# EAGLE schematic processor_toycathon v5 (EAGLE 9.7.0)
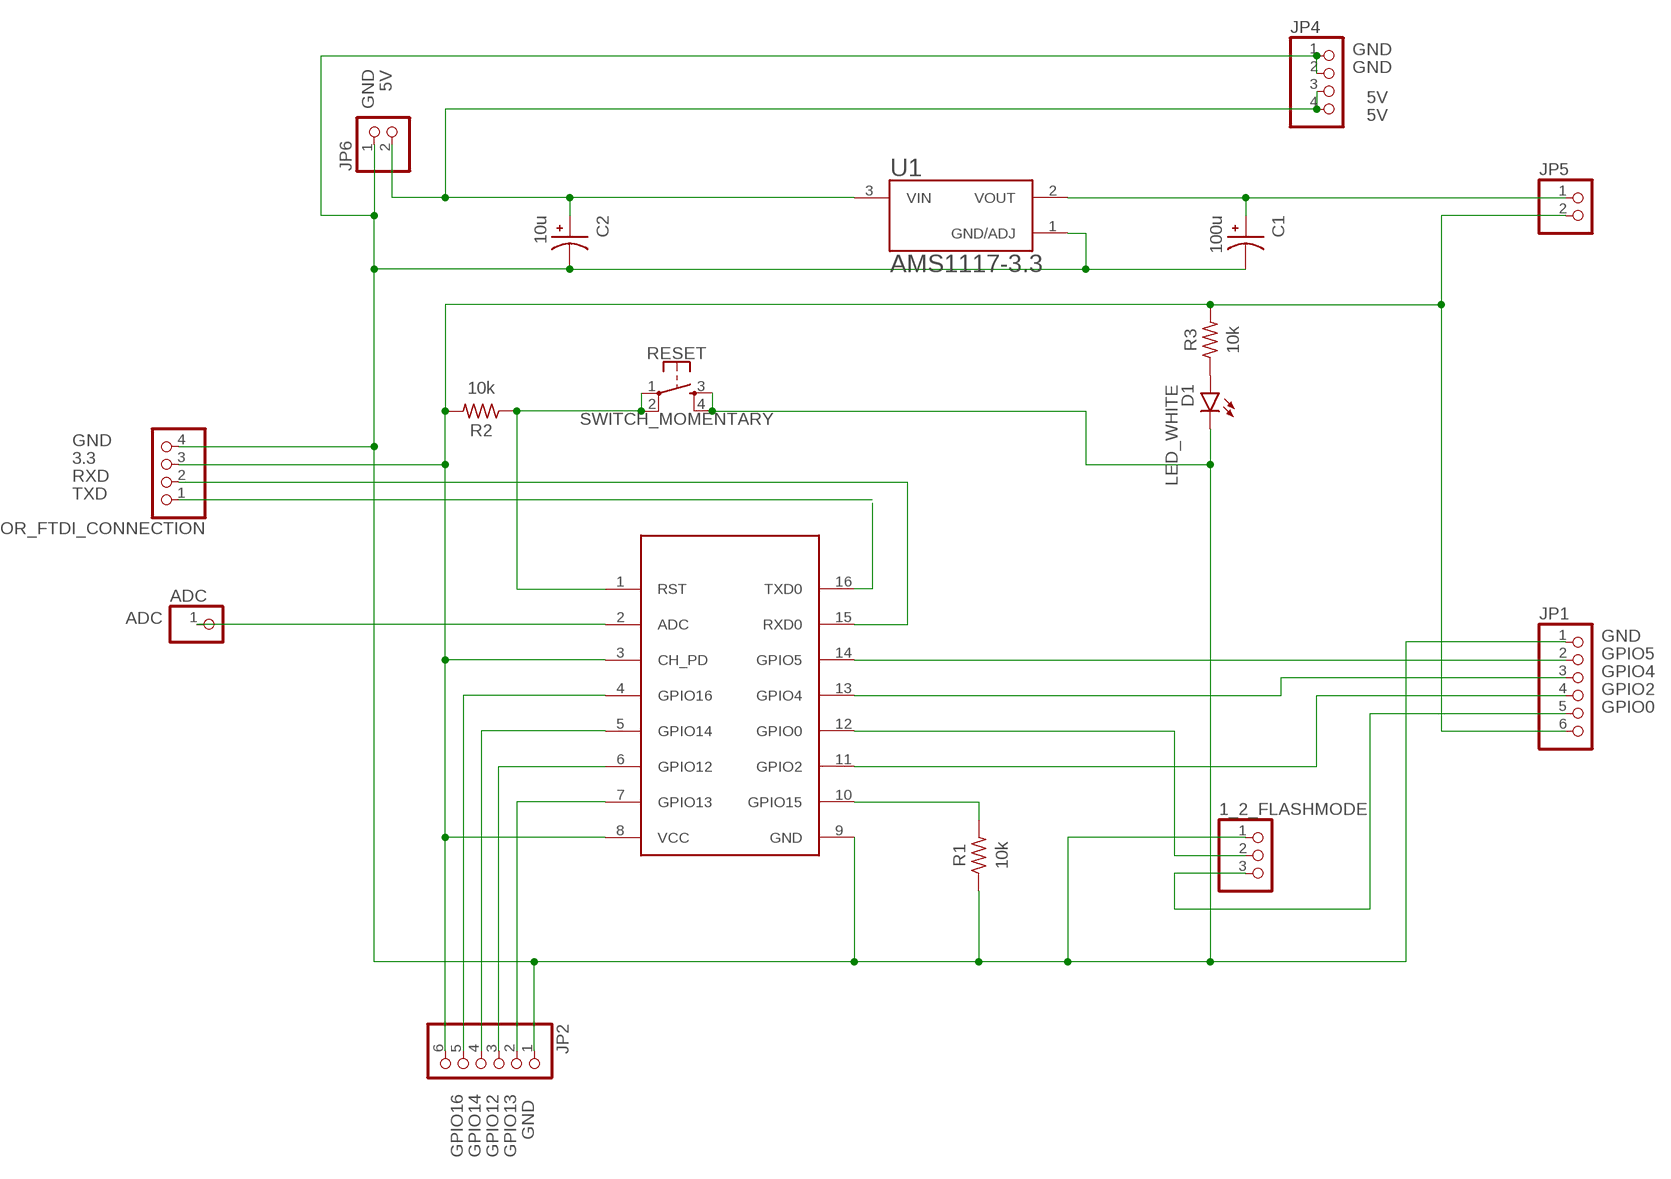
[diagram p0: schematic, sheet 1]

## Parts
1_2_FLASHMODE  PINHD-1X3  [1X03]
ADC  PINHD-1X1  [1X01]
C1  100u  ECEA1EN220XI  [CAPPRD250W50D500H1100]
C2  10u  ECEA1EN220XI  [CAPPRD250W50D500H1100]
D1  LED_WHITE  LED_RADIAL_WHITE  [LEDRD254W60D565H860B_W]
FOR_FTDI_CONNECTION  PINHD-1X4  [1X04]
JP1  PINHD-1X6  [1X06]
JP2  PINHD-1X6  [1X06]
JP4  PINHD-1X4  [1X04]
JP5  PINHD-1X2  [1X02]
JP6  PINHD-1X2  [1X02]
R1  10k  R-US_AXIAL-7.2MM-PITCH  [RESAD724W46L381D178B]
R2  10k  R-US_AXIAL-7.2MM-PITCH  [RESAD724W46L381D178B]
R3  10k  R-US_AXIAL-7.2MM-PITCH  [RESAD724W46L381D178B]
RESET  SWITCH_MOMENTARY  [SWITCH-MOMENTARY-PTH-6.5MM]
U1  AMS1117-3.3  [SOT229P700X180-4N]
U$1  ESP-07  [ESP-07]

## Nets
3.3: FOR_FTDI_CONNECTION.3 JP1.6 JP2.6 JP5.2 R2.2 R3.2 U$1.3(CH_PD) U$1.8(VCC)
5V: C2.P JP4.3 JP4.4 JP6.2 U1.3(VIN)
ADC: ADC.1 U$1.2(ADC)
GND: 1_2_FLASHMODE.1 C1.N C2.N D1.2(C) FOR_FTDI_CONNECTION.4 JP1.1 JP2.1 JP4.1 JP4.2 JP6.1 R1.1 RESET.3 RESET.4 U1.1(GND/ADJ) U$1.9(GND)
GPIO0: 1_2_FLASHMODE.3 JP1.5
GPIO2: JP1.4 U$1.11(GPIO2)
GPIO4: JP1.3 U$1.13(GPIO4)
GPIO5: JP1.2 U$1.14(GPIO5)
GPIO12: JP2.3 U$1.6(GPIO12)
GPIO13: JP2.2 U$1.7(GPIO13)
GPIO14: JP2.4 U$1.5(GPIO14)
GPIO16: JP2.5 U$1.4(GPIO16)
N$1: C1.P JP5.1 U1.2(VOUT)
N$2: R2.1 RESET.1 RESET.2 U$1.1(RST)
N$3: U$1.16(TXD0)
N$4: D1.1(A) R3.1
N$10: R1.2 U$1.10(GPIO15)
N$11: 1_2_FLASHMODE.2 U$1.12(GPIO0)
RXD: FOR_FTDI_CONNECTION.2 U$1.15(RXD0)
TXD: FOR_FTDI_CONNECTION.1

## Library data of the parts
1_2_FLASHMODE = pinhead:PINHD-1X3: PIN HEADER
ADC = pinhead:PINHD-1X1: PIN HEADER
C1 C2 = capacitor_polarising_pinhole:ECEA1EN220XI: Check availability <https://pricing.snapeda.com/parts/ECE-A1EN220XI/Panasonic/view-part?ref=eda>; AVAILABILITY: In Stock; CHECK_PRICES: https://www.snapeda.com/parts/ECE-A1EN220XI/Panasonic/view-part/?ref=eda; DESCRIPTION: Aluminum Electrolytic Capacitors - Radial Leaded 25VDC, 22uF, 5x11 LS2.0; MF: Panasonic; MP: ECE-A1EN220XI; PACKAGE: RADIAL-2 Panasonic; PRICE: None; SNAPEDA_LINK: https://www.snapeda.com/parts/ECE-A1EN220XI/Panasonic/view-part/?ref=snap
D1 = Tinkercad:LED_RADIAL: LED - Generic; CATEGORY: Opto-Electronic; SUB-CATEGORY: LED
FOR_FTDI_CONNECTION JP4 = pinhead:PINHD-1X4: PIN HEADER
JP1 JP2 = pinhead:PINHD-1X6: PIN HEADER
JP5 JP6 = pinhead:PINHD-1X2: PIN HEADER
R1-R3 = Resistor:R-US: Resistor Fixed - ANSI; CATEGORY: Resistor; SUB-CATEGORY: Fixed
RESET = Tinkercad:SWITCH_MOMENTARY
U1 = AMS1117-3.3:AMS1117-3.3: Check availability <https://pricing.snapeda.com/parts/AMS1117-3.3/Advanced%20Monolithic%20Systems/view-part?ref=eda>; AVAILABILITY: Not in stock; CHECK_PRICES: https://www.snapeda.com/parts/AMS1117-3.3/Advanced+Monolithic+Systems/view-part/?ref=eda; DESCRIPTION: Sot223/Pkg 1-Amp 3.3-Volt Low Drop Out Voltage Regulatator; MF: Advanced Monolithic Systems; MP: AMS1117-3.3; PACKAGE: SOT-223 Seeed Technology; PRICE: None; SNAPEDA_LINK: https://www.snapeda.com/parts/AMS1117-3.3/Advanced+Monolithic+Systems/view-part/?ref=snap
U$1 = ESP-07:ESP-07: Check availability <https://pricing.snapeda.com/parts/ESP-07/RF%20Solutions%20Ltd/view-part?ref=eda>; AVAILABILITY: Not in stock; CHECK_PRICES: https://www.snapeda.com/parts/ESP-07/RF/view-part/?ref=eda; DESCRIPTION: WiFi 802.11b/g/n Transceiver Module 2.4GHz ~ 2.5GHz PCB Trace Surface Mount; MF: RF Solutions Ltd; MP: ESP-07; PACKAGE: NON-STANDARD-16 RF SOLUTIONS; PRICE: None; SNAPEDA_LINK: https://www.snapeda.com/parts/ESP-07/RF/view-part/?ref=snap